# Altium schematic sheet psu.SchDoc
size A; SheetNumber: 1; SheetTotal: 1; SPICEModelCacheFTOFCDUO: <root> / <DocumentId>FTOFCDUO</DocumentId> / <CacheFrame Number="0"> / <Model Name="1206_150120ss75000" Kind="CKT"> / <Text>****** / .subckt 1206_150120SS75000  1  2 / D1 1 2 SMCW / .MODEL SMCW D / + IS=10.012E-21 / + N=1.7421 / + RS=1.0000E-6 / + IKF=.26961 / + CJO=1.0000E-12 / + M=.3333 / + VJ=.75 / + BV=5 / + IBV=10.00E-6 / + TT=5.0000E-9 / .ends</Text> / </Model> / </CacheFrame> / </root>
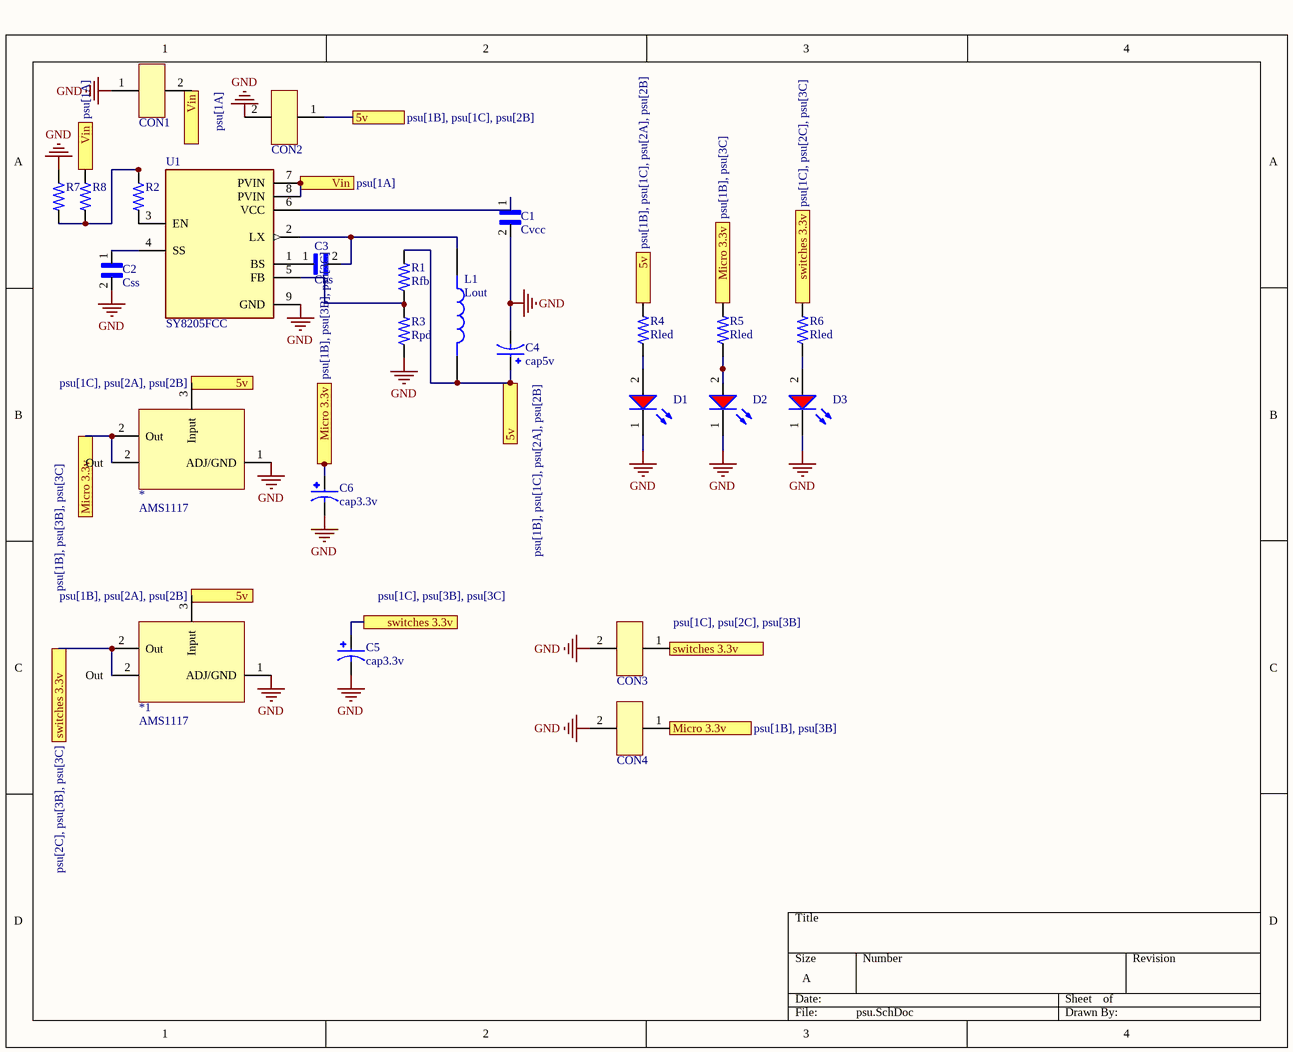
[diagram p0: psu.SchDoc]

## Parts
*  AMS1117  [PCBComponent_1]
*1  AMS1117  [PCBComponent_1]
C1  Cvcc  [CAP3216X125N]
C2  Css  [CAP3216X125N]
C3  Cbs  [CAP3216X125N]
C4  cap5v  [CAP_EEEFPA221XAL]
C5  cap3.3v  [CAP_EEEFPA221XAL]
C6  cap3.3v  [CAP_EEEFPA221XAL]
CON1  CON?  [PCBComponent_1]  (value not drawn)
CON2  CON?  [PCBComponent_1]  (value not drawn)
CON3  CON?  [PCBComponent_1]  (value not drawn)
CON4  CON?  [PCBComponent_1]  (value not drawn)
D1  Super Red, 1.9V, 140°  [WL-SMCW_1206_150120xx75000]  (value not drawn)
D2  Super Red, 1.9V, 140°  [WL-SMCW_1206_150120xx75000]  (value not drawn)
D3  Super Red, 1.9V, 140°  [WL-SMCW_1206_150120xx75000]  (value not drawn)
L1  Lout  [IND_LQH5BPB100MT0L]
R1  Rfb  [RESC3115X65N]
R2  4-2176245-2  [RESC3115X65N]  (value not drawn)
R3  Rpd  [RESC3115X65N]
R4  Rled  [RESC3115X65N]
R5  Rled  [RESC3115X65N]
R6  Rled  [RESC3115X65N]
R7  4-2176245-2  [RESC3115X65N]  (value not drawn)
R8  4-2176245-2  [RESC3115X65N]  (value not drawn)
U1  SY8205FCC  [VREG_SY8205FCC]

## Ports
5v (see psu[1B], psu[1C], psu[2A], psu[2B]), 5v (see psu[1B], psu[1C], psu[2B]), 5v (see psu[1B], psu[2A], psu[2B]), 5v (see psu[1C], psu[2A], psu[2B]), Micro 3.3v (see psu[1B], psu[3B]), Micro 3.3v (see psu[1B], psu[3B], psu[3C]), Micro 3.3v (see psu[1B], psu[3C]), switches 3.3v (see psu[1C], psu[2C], psu[3B]), switches 3.3v (see psu[1C], psu[2C], psu[3C]), switches 3.3v (see psu[1C], psu[3B], psu[3C]), switches 3.3v (see psu[2C], psu[3B], psu[3C]), Vin (see psu[1A])

## Nets
GND: *.1(ADJ/GND) *1.1(ADJ/GND) C1.2 C2.2 C4.2 C5.2 C6.2 CON1.1 CON2.2 CON3.2 CON4.2 D1.1(K) D2.1(K) D3.1(K) R3.1 R7.1 U1.9(GND)
5v: *.3(Input) *1.3(Input) C4.1 CON2.1 L1.2 R1.2 R4.2 ; port 5v
Micro 3.3v: *.2(Out) C6.1 CON4.1 R5.2 ; port Micro 3.3v
switches 3.3v: *1.2(Out) C5.1 CON3.1 R6.2 ; port switches 3.3v
Vin: CON1.2 R8.1 U1.7(PVIN) U1.8(PVIN) ; port Vin
NetC1_1: C1.1 U1.6(VCC)
NetC2_1: C2.1 U1.4(SS)
NetC3_1: C3.1 U1.1(BS)
NetC3_2: C3.2 L1.1 U1.2(LX)
NetD1_2: D1.2(A) R4.1
NetD2_2: D2.2(A) R5.1
NetD3_2: D3.2(A) R6.1
NetR1_1: R1.1 R3.2 U1.5(FB)
NetR2_1: R2.1 R7.2 R8.2
NetR2_2: R2.2 U1.3(EN)

## Library data of the parts
C1-C3 = GRM31CR71H475KA12L: CAP 4.7UF 50VDC X7R 10% SMD 1206; MP: GRM31CR71H475KA12L; Availability: Unavailable; Package: None; Price: None; Value: *
C4-C6 = EEEFPA221XAL: Aluminum Electrolytic Capacitors - SMD 10VDC 220uF 20% 6x8mm AEC-Q200; MP: EEE-FPA221XAL; MF: Panasonic; Availability: In Stock; Price: None; Package: RADIAL-2 Panasonic; Value: *; SnapEDA_Link: https://www.snapeda.com/parts/EEE-FPA221XAL/Panasonic/view-part/6178333/?ref=snap; Check_prices: https://www.snapeda.com/parts/EEE-FPA221XAL/Panasonic/view-part/6178333/?ref=eda; Purchase-URL: https://pricing.snapeda.com/search/part/EEE-FPA221XAL/?ref=eda
D1-D3 = 150120SS75000: WL-SMCW Mono-color Chip LED Waterclear, SMT, size 1206, Super Red, 1.9V, 140°; Manufacturer: Wurth Elektronik; Case/Size Code: 1206; Chip Technology: AlInGaP; Dominant Wavelength: 630nm; Luminous Intensity: 60mcd; Peak Wavelength: 645nm; Manufacturer Part Number: 150120SS75000; Category: Signal LEDs; Match Code: WL-SMCW; ComponentLink1Description: Website Link; ComponentLink1URL: https://www.we-online.com/redexpert/article/150120SS75000?ad; ComponentLink2Description: Datasheet Link; ComponentLink2URL: https://www.we-online.com/redexpert/spec/150120SS75000?ad; Mount: Surface Mount; Operating Temperature Max: 85°C; Operating Temperature Min: -40°C; Packaging: Tape and Reel; Length: 3.2mm; Width: 1.6mm; Height: 0.68mm; Emitting Color: Super Red; Forward Voltage: 1.9V; Viewing Angle: 140°
L1 = LQH5BPB100MT0L: Inductor with Inductance: 10uH Tol. +/-20%, Package: 2020 (5050); MF: Murata; Package: NONSTANDARD; MP: LQH5BPB100MT0L; Check_prices: https://www.snapeda.com/parts/LQH5BPB100MT0L/Murata/view-part/4547622/?ref=eda; Value: *; SnapEDA_Link: https://www.snapeda.com/parts/LQH5BPB100MT0L/Murata/view-part/4547622/?ref=snap; Digi-Key_Part_Number: 490-9930-1-ND; Purchase-URL: https://pricing.snapeda.com/search/part/LQH5BPB100MT0L/?ref=eda
R1 R2 R4-R8 = 4-2176245-2: CRGS1206 5% 2K7; Package: None; Price: None; Value: *; MP: 4-2176245-2; Availability: Unavailable
R3 = 4-2176245-2: Package: None; Price: None; Value: *; MP: 4-2176245-2; Availability: Unavailable
U1 = SY8205FCC: High-Efficiency Fast Responseï¼Œ5A, 30V Input Synchronous Step Down Regulator; MF: Silergy; SnapEDA_Link: https://www.snapeda.com/parts/SY8205FCC/Silergy/view-part/?ref=snap; Package: Package; Value: *; MP: SY8205FCC; Check_prices: https://www.snapeda.com/parts/SY8205FCC/Silergy/view-part/?ref=eda